# EAGLE design untitled (EAGLE 7.2.0)
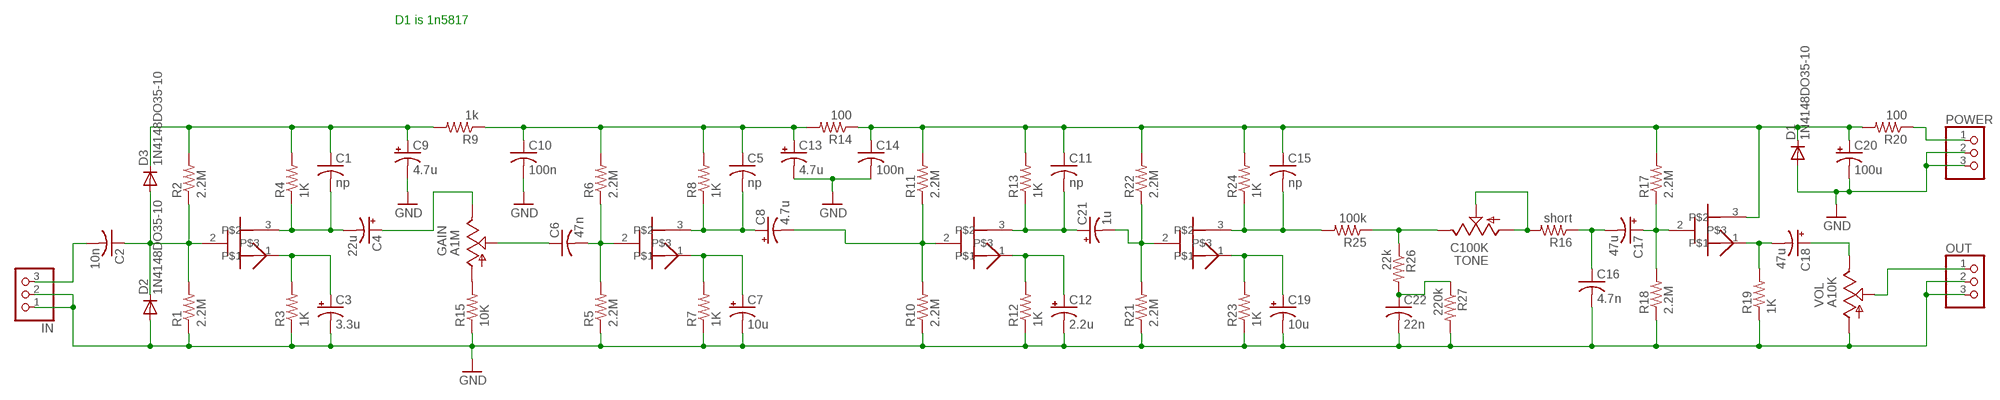
[diagram p0: schematic, sheet 1]

## Parts
C1  np  C-US050-030X075  [C050-030X075]
C2  10n  C-US050-030X075  [C050-030X075]
C3  3.3u  CPOL-USE2-5  [E2-5]
C4  22u  CPOL-USE2-5  [E2-5]
C5  np  C-US050-030X075  [C050-030X075]
C6  47n  C-US050-030X075  [C050-030X075]
C7  10u  CPOL-USE2-5  [E2-5]
C8  4.7u  CPOL-USE2-5  [E2-5]
C9  4.7u  CPOL-USE2-5  [E2-5]
C10  100n  C-US050-030X075  [C050-030X075]
C11  np  C-US050-030X075  [C050-030X075]
C12  2.2u  CPOL-USE2-5  [E2-5]
C13  4.7u  CPOL-USE2-5  [E2-5]
C14  100n  C-US050-030X075  [C050-030X075]
C15  np  C-US050-030X075  [C050-030X075]
C16  4.7n  C-US050-030X075  [C050-030X075]
C17  47u  CPOL-USE2-5  [E2-5]
C18  47u  CPOL-USE2-5  [E2-5]
C19  10u  CPOL-USE2-5  [E2-5]
C20  100u  CPOL-USE2-5  [E2-5]
C21  1u  CPOL-USE2-5  [E2-5]
C22  22n  C-US050-030X075  [C050-030X075]
D1  1N4148DO35-10  [DO35-10]
D2  1N4148DO35-10  [DO35-10]
D3  1N4148DO35-10  [DO35-10]
GAIN  A1M  PEDALPOT  [3RP/1610N]
IN  PINHD-1X3  [1X03]
OUT  PINHD-1X3  [1X03]
POWER  PINHD-1X3  [1X03]
R1  2.2M  R-US_0207/7  [0207/7]
R2  2.2M  R-US_0207/7  [0207/7]
R3  1K  R-US_0207/7  [0207/7]
R4  1K  R-US_0207/7  [0207/7]
R5  2.2M  R-US_0207/7  [0207/7]
R6  2.2M  R-US_0207/7  [0207/7]
R7  1K  R-US_0207/7  [0207/7]
R8  1K  R-US_0207/7  [0207/7]
R9  1k  R-US_0207/7  [0207/7]
R10  2.2M  R-US_0207/7  [0207/7]
R11  2.2M  R-US_0207/7  [0207/7]
R12  1K  R-US_0207/7  [0207/7]
R13  1K  R-US_0207/7  [0207/7]
R14  100  R-US_0207/7  [0207/7]
R15  10K  R-US_0207/7  [0207/7]
R16  short  R-US_0207/7  [0207/7]
R17  2.2M  R-US_0207/7  [0207/7]
R18  2.2M  R-US_0207/7  [0207/7]
R19  1K  R-US_0207/7  [0207/7]
R20  100  R-US_0207/7  [0207/7]
R21  2.2M  R-US_0207/7  [0207/7]
R22  2.2M  R-US_0207/7  [0207/7]
R23  1K  R-US_0207/7  [0207/7]
R24  1K  R-US_0207/7  [0207/7]
R25  100k  R-US_0207/7  [0207/7]
R26  22k  R-US_0207/7  [0207/7]
R27  220k  R-US_0207/7  [0207/7]
TONE  C100K  PEDALPOT  [3RP/1610N]
U$1  2N7000_2  [TO92]
U$2  2N7000_2  [TO92]
U$3  2N7000_2  [TO92]
U$4  2N7000_2  [TO92]
U$5  2N7000_2  [TO92]
VOL  A10K  PEDALPOT  [3RP/1610N]

## Nets
GND: C3.- C7.- C9.- C10.2 C12.- C13.- C14.2 C16.2 C19.- C20.- C22.2 D1.A D2.A IN.1 IN.2 OUT.2 OUT.3 POWER.2 POWER.3 R1.1 R3.1 R5.1 R7.1 R10.1 R12.1 R15.1 R18.1 R19.1 R21.1 R23.1 R27.2 VOL.3(A)
N$1: C2.1 D2.C D3.A R1.2 R2.1 U$1.2
N$2: C1.2 C4.- R4.1 U$1.3
N$3: C1.1 C9.+ D3.C R2.2 R4.2 R9.2
N$4: C4.+ GAIN.1(E)
N$5: C3.+ R3.2 U$1.1
N$6: C6.2 R5.2 R6.1 U$2.2
N$7: C5.2 C8.+ R8.1 U$2.3
N$8: C2.2 IN.3
N$9: C7.+ R7.2 U$2.1
N$10: C16.1 C17.- R16.1
N$11: C6.1 GAIN.2(S)
N$12: C11.2 C21.+ R13.1 U$3.3
N$13: C5.1 C10.1 C13.+ R6.2 R8.2 R9.1 R14.2
N$14: C12.+ R12.2 U$3.1
N$15: C8.- R10.2 R11.1 U$3.2
N$16: GAIN.3(A) R15.2
N$18: POWER.1 R20.1
N$19: C17.+ R17.1 R18.2 U$4.2
N$20: C11.1 C14.1 C15.1 C20.+ D1.C R11.2 R13.2 R14.1 R17.2 R20.2 R22.2 R24.2 U$4.3
N$21: R16.2 TONE.2(S) TONE.3(A)
N$22: C18.- R19.2 U$4.1
N$23: C18.+ VOL.1(E)
N$24: C15.2 R24.1 R25.2 U$5.3
N$25: OUT.1 VOL.2(S)
N$26: C19.+ R23.2 U$5.1
N$27: C21.- R21.2 R22.1 U$5.2
N$28: C22.1 R26.2 R27.1
N$29: R25.1 R26.1 TONE.1(E)

## Notes on the sheet
- D1 is 1n5817

## Library data of the parts
C1 C2 C5 C6 C10 C11 C14-C16 C22 = dan:C-US: CAPACITOR, American symbol
C3 C4 C7-C9 C12 C13 C17-C21 = dan:CPOL-US: POLARIZED CAPACITOR, American symbol
D1-D3 = dan:1N4148: DIODE high speed (Philips)
GAIN TONE VOL = dan:PEDALPOT
IN OUT POWER = dan:PINHD-1X3: PIN HEADER
R1-R27 = dan:R-US_: RESISTOR, American symbol
U$1-U$5 = dan:2N7000_2

## Board
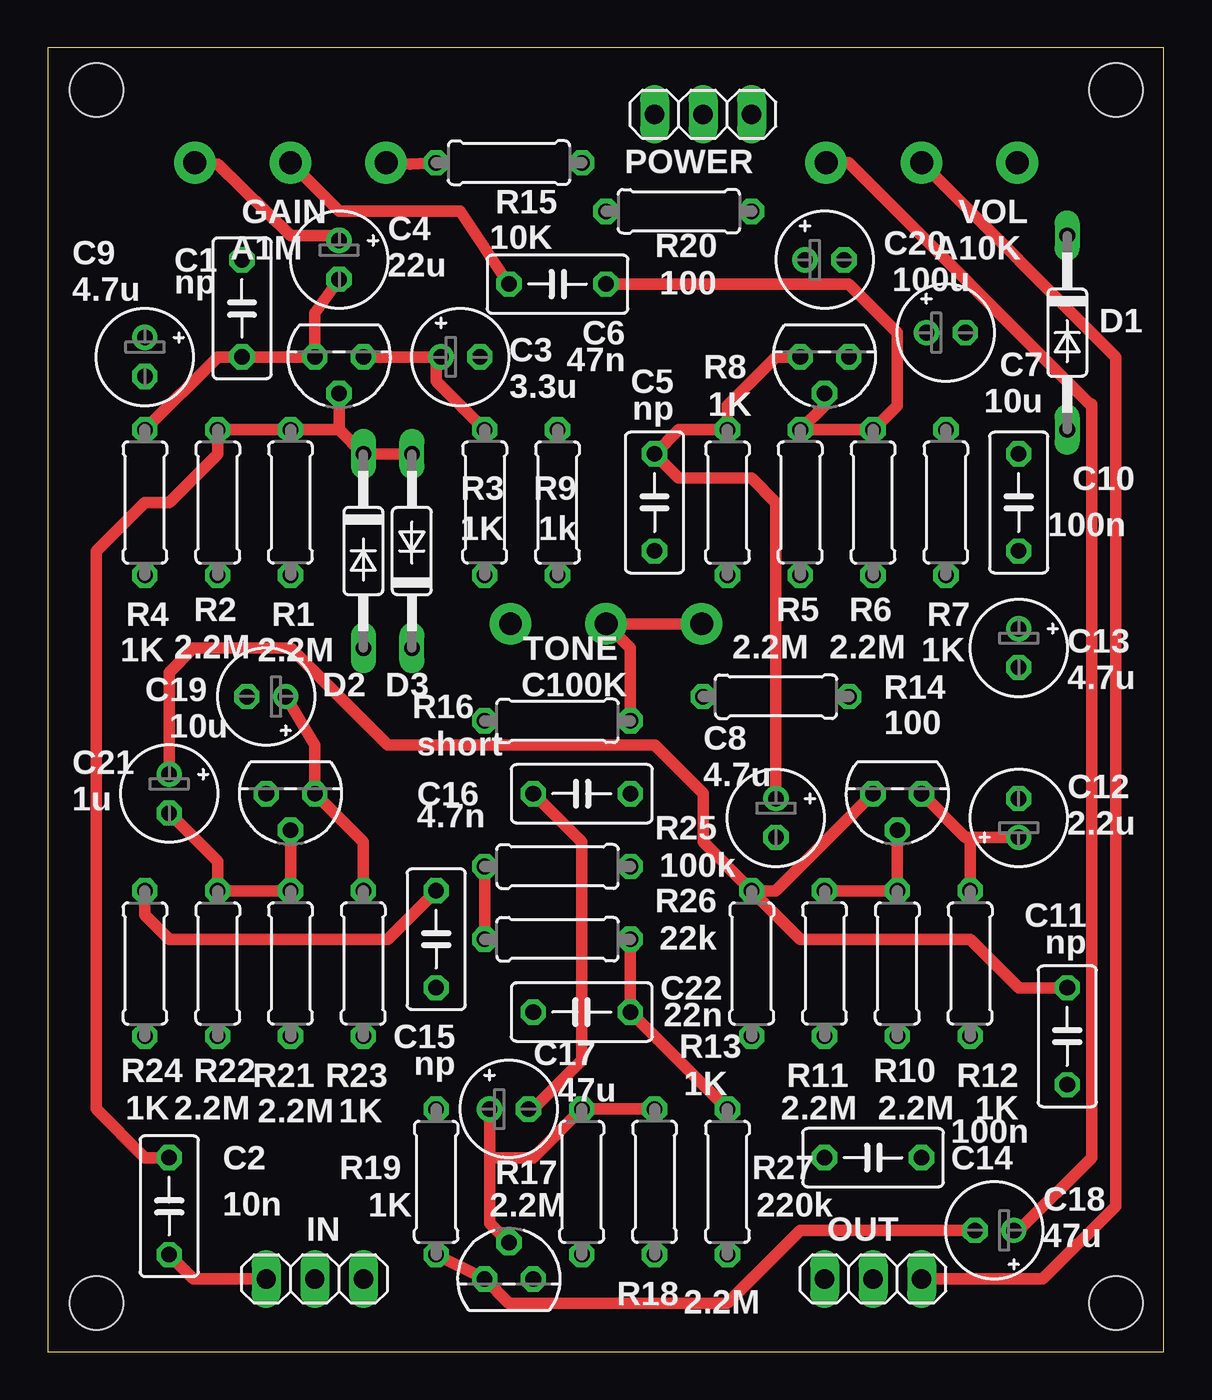
[diagram p1: board, top side]
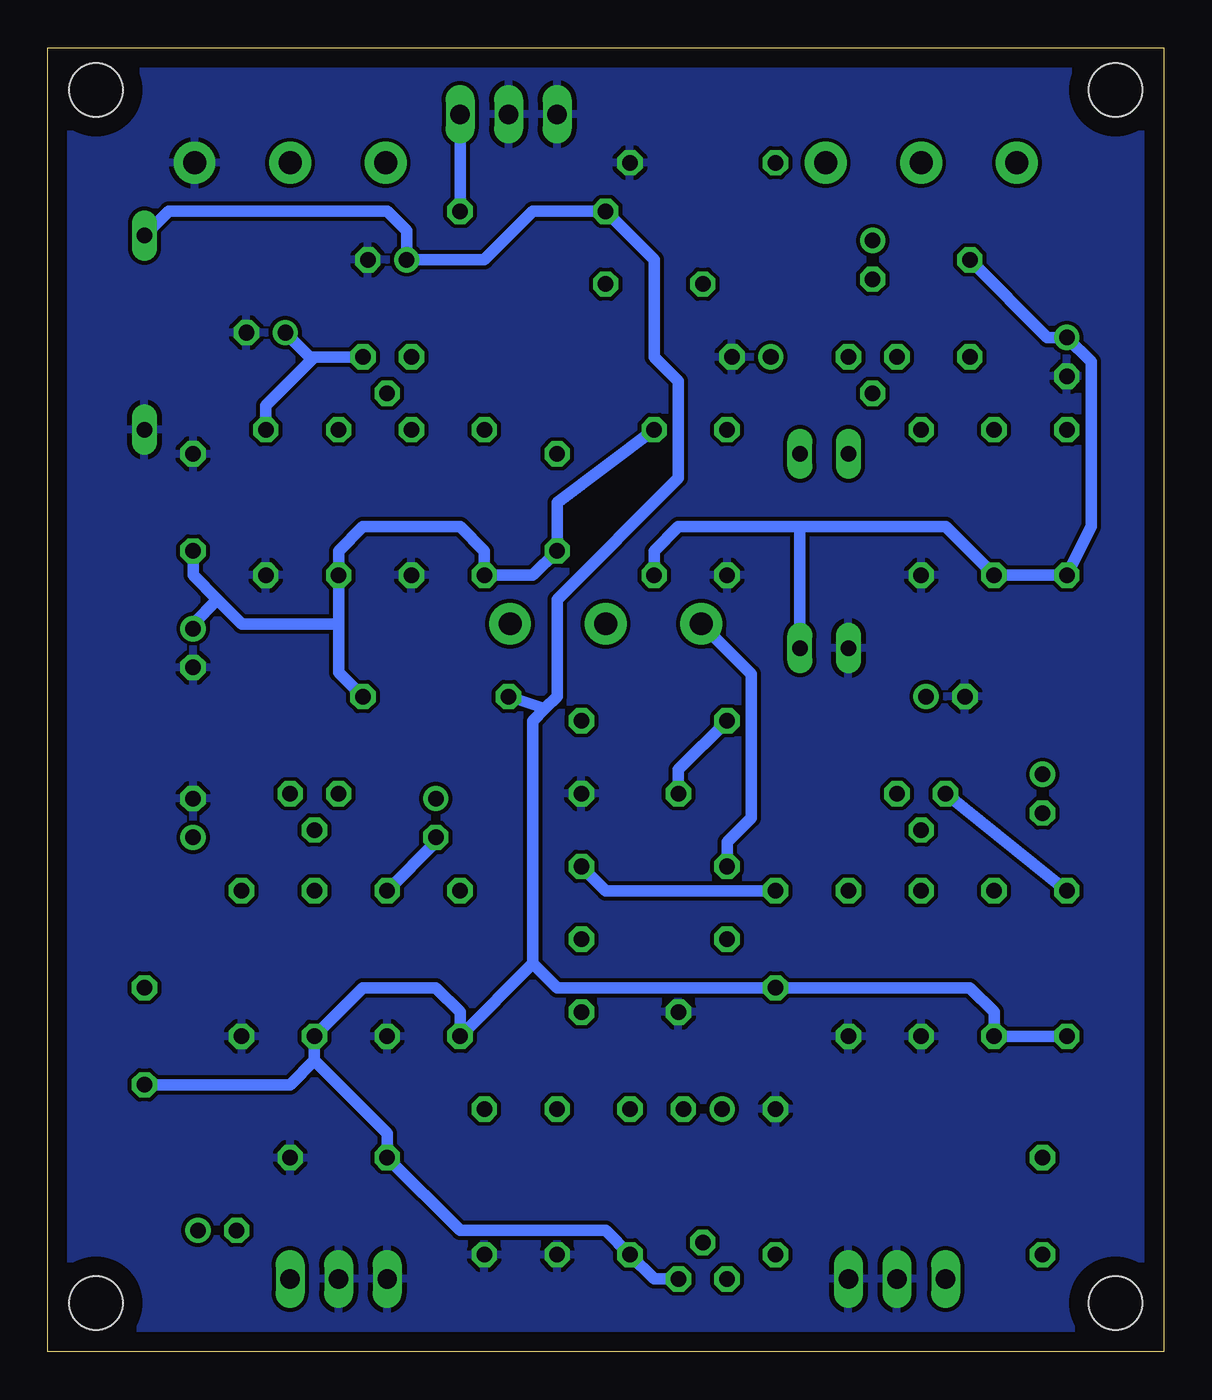
[diagram p2: board, bottom side, seen from below]

Size 58.4 x 68.25 mm. Coordinates in mm from the lower left corner, seen from the top.
Outline: 0,0 58.4,0 58.4,68.25 0,68.25 0,0
Copper layers (1*16): Top 0.035mm / dielectric 1.5mm / Bottom 0.035mm
Design rules "default": minimum track width 10mil, minimum drill 24mil, track to track 8mil, track to pad 8mil, pad to pad 8mil, via to via 8mil, smd to smd 8mil, copper to edge 40mil, drill to drill 8mil, minimum pad ring 10mil, minimum via ring 8mil, stop-mask expansion 4mil, vias tented up to drill 0mil, thermal gap 10mil
Holes 2.8 mm at 2.54,2.54 2.54,66.04 55.88,66.04 55.88,2.54

### Footprints (pad centres in the part's own frame; a part is rotated, then mirrored left to right if it is on the bottom)
C050-030X075 = drill 0.813 octagon: 1 -2.54,0; 2 2.54,0
E2-5 = drill 0.813 pad 1.27: + -1.016,0 | drill 0.813 pad 1.27 octagon: - 1.016,0
DO35-10 = drill 0.813 long: A 5.08,0; C -5.08,0
3RP/1610N = drill 1.2 pad 2.184: 1 -5,0; 2 0,0; 3 5,0
1X03 = drill 1.016 long: 1 -2.54,0; 2 0,0; 3 2.54,0
0207/7 = drill 0.813 octagon: 1 -3.81,0; 2 3.81,0
TO92 = drill 0.813 octagon: 1 -1.27,0; 2 0,1.905; 3 1.27,0

### Placement (x,y rotation side)
C1  10.16,54.61 270 top
C2  6.35,7.62 270 top
C3  21.59,52.07 0 top
C4  15.24,57.15 270 top
C5  31.75,44.45 90 top
C6  26.67,55.88 0 top
C7  46.99,53.34 0 top
C8  38.1,27.94 270 top
C9  5.08,52.07 270 top
C10  50.8,44.45 90 top
C11  53.34,16.51 90 top
C12  50.8,27.94 90 top
C13  50.8,36.83 270 top
C14  43.18,10.16 0 top
C15  20.32,21.59 90 top
C16  27.94,29.21 0 top
C17  24.13,12.7 0 top
C18  49.53,6.35 180 top
C19  11.43,34.29 180 top
C20  40.64,57.15 0 top
C21  6.35,29.21 270 top
C22  27.94,17.78 180 top
D1  53.34,53.34 270 top
D2  16.51,41.91 270 top
D3  19.05,41.91 90 top
GAIN  12.7,62.23 180 bottom
IN  13.97,3.81 180 top
OUT  43.18,3.81 180 top
POWER  34.29,64.77 180 top
R1  12.7,44.45 90 top
R2  8.89,44.45 270 top
R3  22.86,44.45 90 top
R4  5.08,44.45 270 top
R5  39.37,44.45 90 top
R6  43.18,44.45 270 top
R7  46.99,44.45 90 top
R8  35.56,44.45 270 top
R9  26.67,44.45 270 top
R10  40.64,20.32 90 top
R11  44.45,20.32 270 top
R12  48.26,20.32 90 top
R13  36.83,20.32 270 top
R14  38.1,34.29 0 top
R15  24.13,62.23 180 top
R16  26.67,33.02 0 top
R17  27.94,8.89 270 top
R18  31.75,8.89 90 top
R19  20.32,8.89 270 top
R20  33.02,59.69 180 top
R21  12.7,20.32 90 top
R22  8.89,20.32 270 top
R23  16.51,20.32 90 top
R24  5.08,20.32 270 top
R25  26.67,25.4 0 top
R26  26.67,21.59 0 top
R27  35.56,8.89 270 top
TONE  29.21,38.1 0 top
U$1  15.24,52.07 180 top
U$2  40.64,52.07 180 top
U$3  44.45,29.21 180 top
U$4  24.13,3.81 0 top
U$5  12.7,29.21 180 top
VOL  45.72,62.23 0 top

### Tracks (layer width: path | path; a pad name or v marks a point on that pad's centre or on a via)
GND
  pour Bottom: -1.27,80.01 60.96,80.01 60.96,-1.27 -1.27,-1.27
N$1
  Top 0.61: 15.24,48.26 R1.2 R2.1 8.89,46.99 6.35,44.45 5.08,44.45 2.54,41.91 2.54,12.7 5.08,10.16 C2.1 | 15.24,48.26 D2.C D3.A | U$1.2 15.24,48.26
N$2
  Top 0.61: C4.- 13.97,54.36 U$1.3 C1.2 8.89,52.07 R4.1
N$3
  Bottom 0.61: C1.1 6.1,53.09 C9.+ 3.81,51.82 3.81,43.18 R4.2 R2.2 11.43,43.18 19.05,43.18 | 19.05,43.18 25.4,43.18 26.67,41.91 R9.2 | D3.C 19.05,43.18
N$4
  Top 0.61: C4.+ 15.24,58.42 12.7,58.42 8.89,62.15 GAIN.1
N$5
  Top 0.61: U$1.1 20.32,52.07 | 20.32,52.07 C3.+ 20.32,51.82 | 20.32,52.07 20.32,51.82 | R3.2 20.32,50.8 20.32,51.82
N$6
  Top 0.61: U$2.2 40.64,49.53 R5.2 R6.1 44.45,49.53 44.45,53.34 41.91,55.88 C6.2
N$7
  Top 0.61: U$2.3 38.1,52.07 35.56,49.53 R8.1 33.02,48.26 C5.2 33.02,45.72 36.83,45.72 38.1,44.45 C8.+
N$8
  Top 0.61: IN.3 7.62,3.81 C2.2
N$9
  Bottom 0.61: U$2.1 44.45,52.07 | 44.45,52.07 44.7,52.07 C7.+ | R7.2 46.99,49.53 44.45,52.07
N$10
  Top 0.61: C17.- 25.4,12.7 27.94,15.24 27.94,26.67 C16.1
  Bottom 0.61: C16.1 25.4,30.48 R16.1
N$11
  Top 0.61: GAIN.2 15.24,59.69 21.59,59.69 C6.1
N$12
  Top 0.61: U$3.3 38.1,24.13 R13.1 | C21.+ 6.35,35.56 7.62,36.83 12.7,36.83 17.78,31.75 31.75,31.75 34.29,29.21 34.29,26.67 R13.1 | C11.2 50.8,19.05 48.26,21.59 39.37,21.59 R13.1
N$13
  Bottom 0.61: R9.1 31.75,44.45 C5.1 33.02,40.64 R8.2 35.56,41.91 36.83,43.18 41.91,43.18 43.18,41.91 R6.2 43.18,38.1 | 43.18,38.1 43.18,35.56 R14.2 | C10.1 50.8,40.64 49.53,39.37 | 49.53,39.37 48.26,38.1 43.18,38.1 | C13.+ 50.8,38.1 49.53,39.37
N$14
  Top 0.61: C12.+ 48.26,26.92 | 48.26,26.92 48.01,26.92 U$3.1 | R12.2 48.26,26.92
N$15
  Top 0.61: U$3.2 R11.1 R10.2 40.64,24.38
  Bottom 0.61: C8.- 38.1,26.67 R10.2
N$16
  Top 0.61: GAIN.3 18.97,62.15 R15.2
N$18
  Bottom 0.61: POWER.1 R20.1
N$19
  Top 0.61: 23.11,10.16 23.11,6.73 U$4.2 | R18.2 R17.1 25.4,10.16 23.11,10.16 | 23.11,12.45 C17.+ 22.86,12.7 23.11,12.45 | 23.11,10.16 23.11,12.45
N$20
  Bottom 0.61: 32.38,33.66 31.75,34.29 31.75,39.37 25.4,45.72 25.4,50.8 26.67,52.07 26.67,57.15 R20.2 33.02,59.69 35.56,57.15 C20.+ 39.62,58.67 40.64,59.69 52.07,59.69 D1.C | 32.38,33.66 33.02,33.02 33.02,20.32 | 33.02,20.32 R13.2 36.83,17.78 38.1,19.05 41.91,19.05 R11.2 44.45,15.24 | R14.1 32.38,33.66 | R24.2 R22.2 8.89,17.78 10.16,19.05 C15.1 31.75,19.05 33.02,20.32 | 44.45,15.24 40.64,11.43 C14.1 36.83,6.35 29.21,6.35 R17.2 26.67,3.81 U$4.3 | C11.1 45.72,13.97 44.45,15.24
N$21
  Top 0.61: TONE.3 TONE.2 30.48,36.83 R16.2
N$22
  Top 0.61: R19.2 U$4.1 24.13,2.54 35.56,2.54 39.37,6.35 C18.-
N$23
  Top 0.61: C18.+ 50.8,6.35 54.61,10.16 54.61,49.61 54.53,49.61 41.91,62.23 VOL.1
N$24
  Top 0.61: C15.2 17.78,21.59 6.35,21.59 5.08,22.86 R24.1
  Bottom 0.61: R24.1 U$5.3 | R25.2 29.21,24.13 C15.2
N$25
  Top 0.61: OUT.1 52.07,3.81 55.88,7.62 55.88,52.07 VOL.2
N$26
  Top 0.61: C19.+ 13.97,31.75 U$5.1 16.51,26.67 R23.2
N$27
  Top 0.61: U$5.2 R21.2 R22.1 8.89,25.65 C21.-
N$28
  Top 0.61: R26.2 C22.1 R27.1
N$29
  Top 0.61: R26.1 R25.1
  Bottom 0.61: R25.1 22.86,26.67 21.59,27.94 21.59,35.48 TONE.1